# EAGLE design RealTimeClock (EAGLE 6.3)
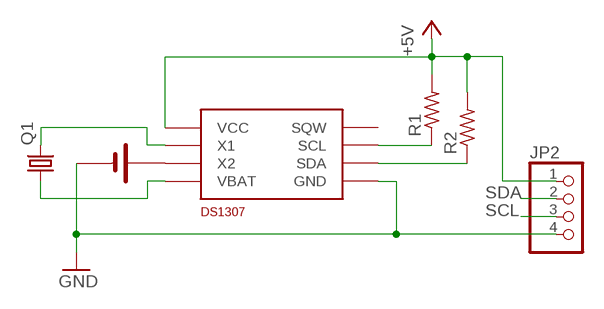
[diagram p0: schematic, sheet 1]

## Parts
CR2032  CR2032  [CR2032]
JP2  PINHD-1X4/90  [1X04/90]
Q1  CRYSTALTC38H  [TC38H]
R1  R-US_0204/7  [0204/7]
R2  R-US_0204/7  [0204/7]
U$1  DS1307  [DS1307]

## Nets
+5V: JP2.1 R1.2 R2.2 U$1.VCC
GND: CR2032.VCC JP2.4 U$1.GND
N$2: CR2032.GND U$1.X2
N$4: Q1.2 U$1.X1
N$5: Q1.1 U$1.VBAT
SCL: JP2.3 R1.1 U$1.SCL
SDA: JP2.2 R2.1 U$1.SDA
Unconnected: U$1.SQW

## Library data of the parts
CR2032 = CustumLib:CR2032
JP2 = pinhead:PINHD-1X4: PIN HEADER
Q1 = crystal:CRYSTAL: CRYSTAL; OC_FARNELL: unknown; OC_NEWARK: unknown
R1 R2 = resistor:R-US_: RESISTOR, American symbol
U$1 = Electronica60:DS1307: RTC DS1307 Circuito Reloj de Tiempo Real, se comunica por medio de la interfaz I2C

## Board
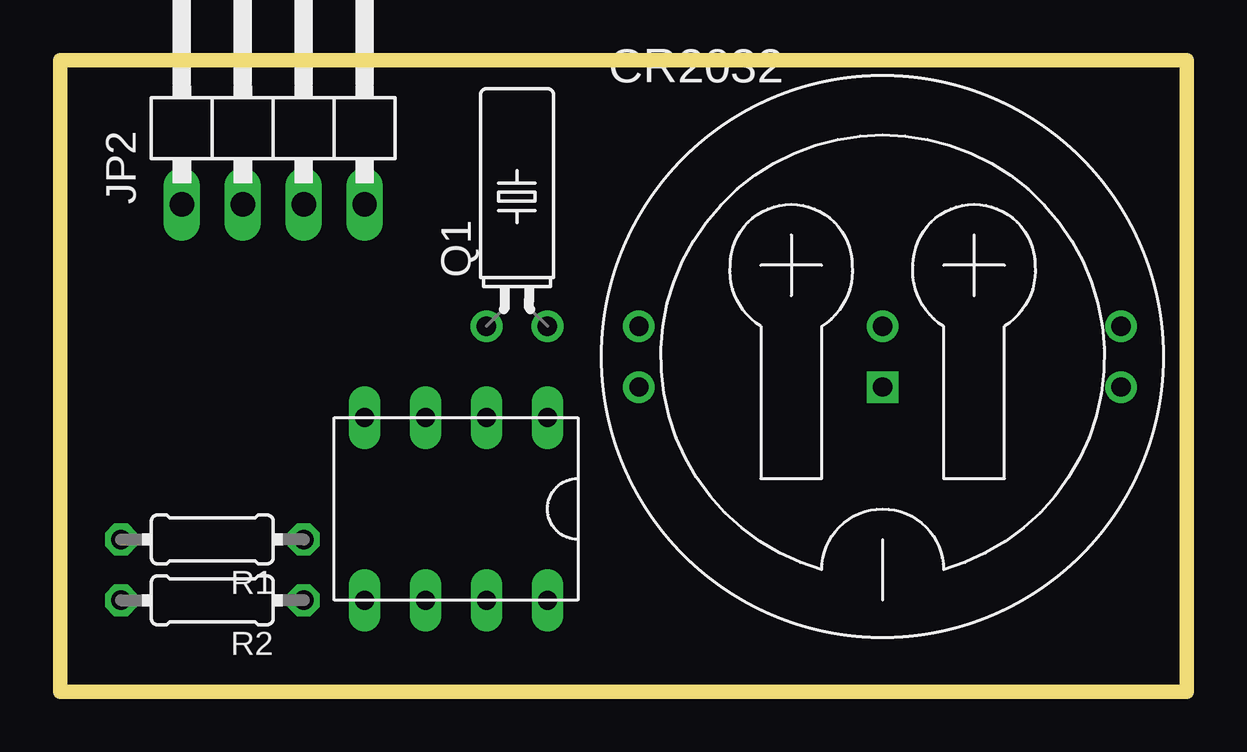
[diagram p1: board, top side]
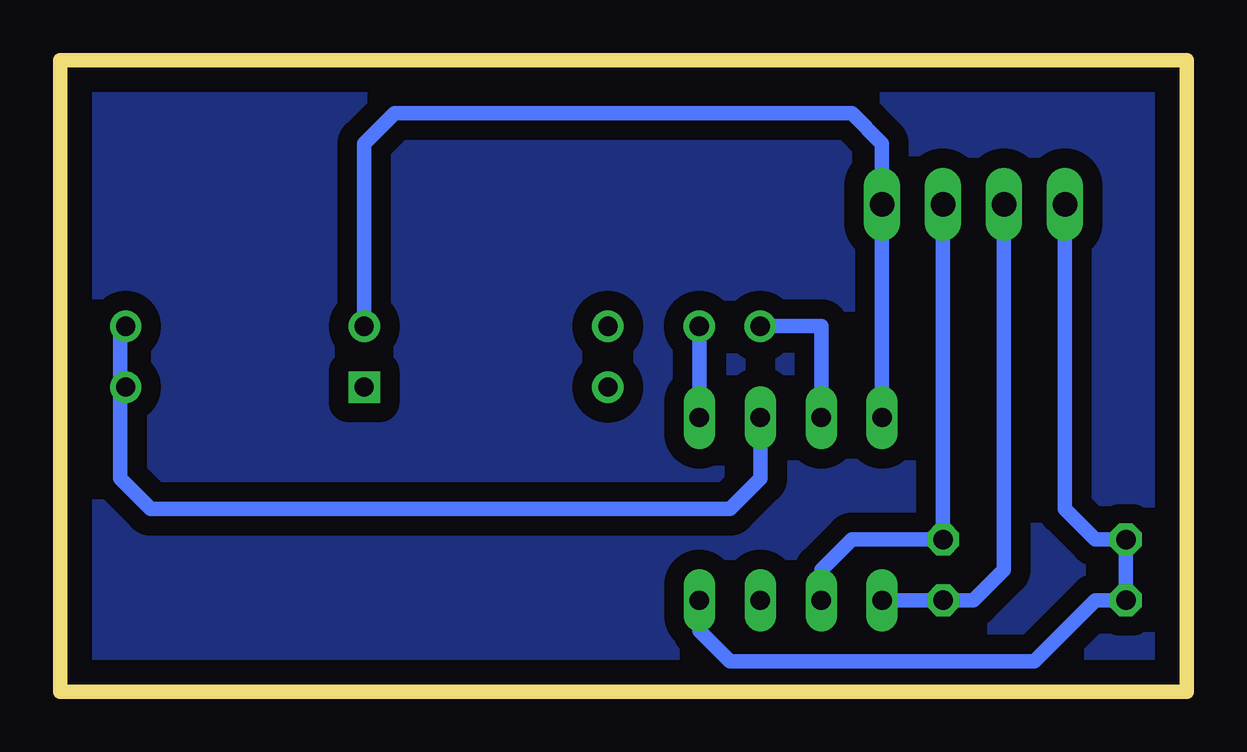
[diagram p2: board, bottom side, seen from below]

Size 46.97 x 26.34 mm. Coordinates in mm from the lower left corner, seen from the top.
Outline: 0,0 46.97,0 46.97,26.34 0,26.34 0,0
Copper layers (1*16): Top 0.035mm / dielectric 1.5mm / Bottom 0.035mm
Design rules "default": minimum track width 10mil, minimum drill 24mil, track to track 8mil, track to pad 8mil, pad to pad 8mil, via to via 8mil, smd to smd 8mil, copper to edge 40mil, drill to drill 8mil, minimum pad ring 10mil, minimum via ring 8mil, stop-mask expansion 4mil, vias tented up to drill 0mil, thermal gap 10mil

### Footprints (pad centres in the part's own frame; a part is rotated, then mirrored left to right if it is on the bottom)
CR2032 = drill 0.8: GND -1.27,9.94; P$1 1.27,9.94; P$2 -1.27,-10.16; P$3 1.27,-10.16; VCC -1.27,0 | drill 0.8 square: P$4 1.27,0
1X04/90 = drill 1.016 long: 1 -3.81,-3.81; 2 -1.27,-3.81; 3 1.27,-3.81; 4 3.81,-3.81
TC38H = drill 0.813: 1 -1.27,0; 2 1.27,0
0204/7 = drill 0.813 octagon: 1 -3.81,0; 2 3.81,0
DS1307 = drill 0.8 long: GND 3.81,-3.81; SCL 1.27,3.81; SDA 3.81,3.81; SQW -1.27,3.81; VBAT 1.27,-3.81; VCC -3.81,3.81; X1 -3.81,-3.81; X2 -1.27,-3.81

### Placement (x,y rotation side)
CR2032  34.29,13.97 270 top
JP2  8.89,24.13 0 top
Q1  19.05,15.24 0 top
R1  6.35,6.35 180 top
R2  6.35,3.81 180 top
U$1  16.51,7.62 180 top

### Tracks (layer width: path | path; a pad name or v marks a point on that pad's centre or on a via)
+5V
  Bottom 0.61: JP2.1 5.08,7.62 3.81,6.35 R1.2 R2.2 3.81,3.81 6.35,1.27 19.05,1.27 20.32,2.54 U$1.VCC
GND
  Bottom 0.61: CR2032.VCC 34.29,22.86 33.02,24.13 13.97,24.13 12.7,22.86 JP2.4 U$1.GND
N$1
  pour Bottom (isolate 0.813): 0,0 0,26.67 46.99,26.67 46.99,0
N$2
  Bottom 0.61: U$1.X2 17.78,8.89 19.05,7.62 43.18,7.62 44.45,8.89 44.45,15.02 CR2032.GND
N$4
  Bottom 0.61: Q1.2 U$1.X1
N$5
  Bottom 0.61: Q1.1 15.24,15.24 U$1.VBAT
SCL
  Bottom 0.61: JP2.3 R1.1 13.97,6.35 15.24,5.08 U$1.SCL
SDA
  Bottom 0.61: JP2.2 7.62,5.08 8.89,3.81 R2.1 U$1.SDA

### Text on the board
Etiquetas: 32.768 Mhz | VCC | SDA | SCL | GND | 10 K | DS1307 | 10 K